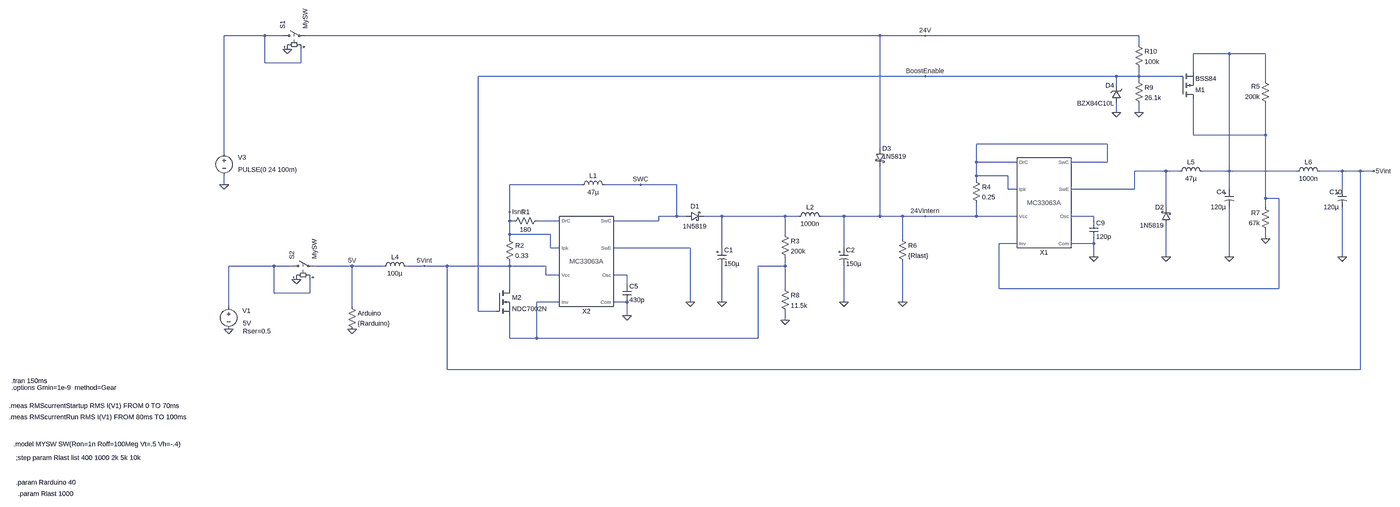
[diagram p0: schematic BuckBoostConverter.asc, whole sheet]
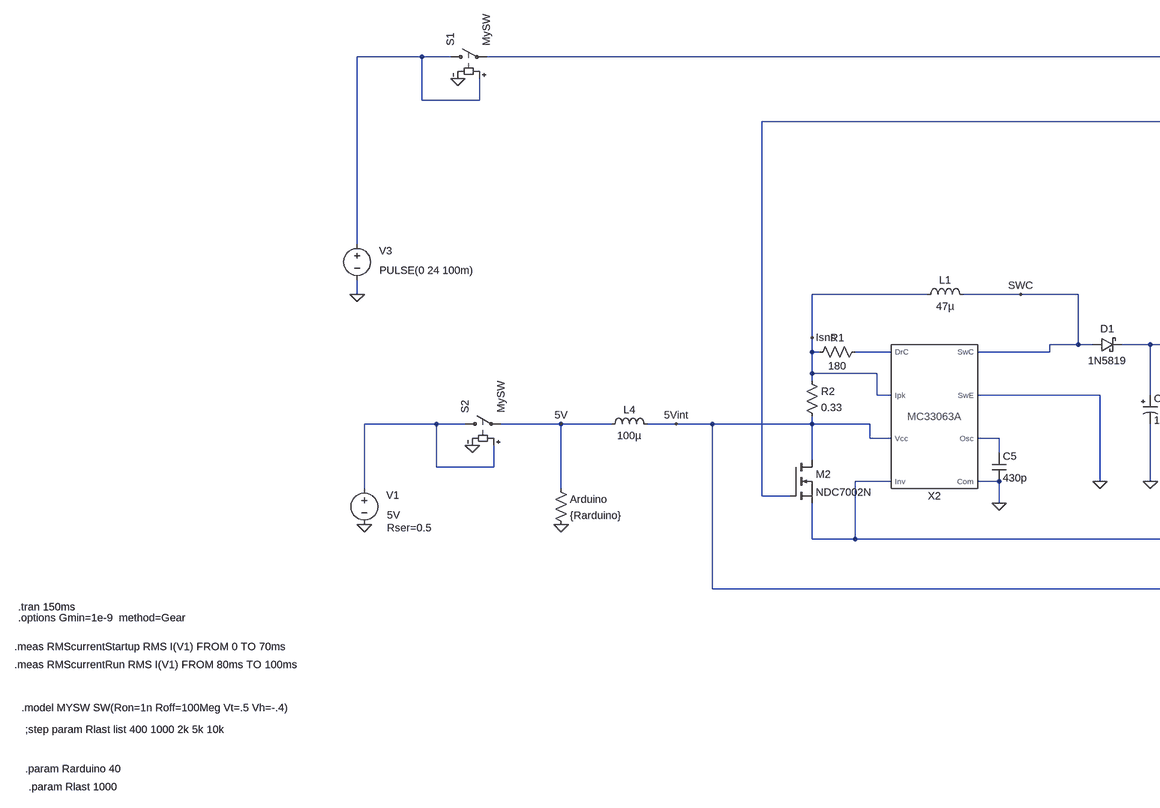
[diagram p1: schematic BuckBoostConverter.asc, part, row 1 of 1, column 1 of 2]
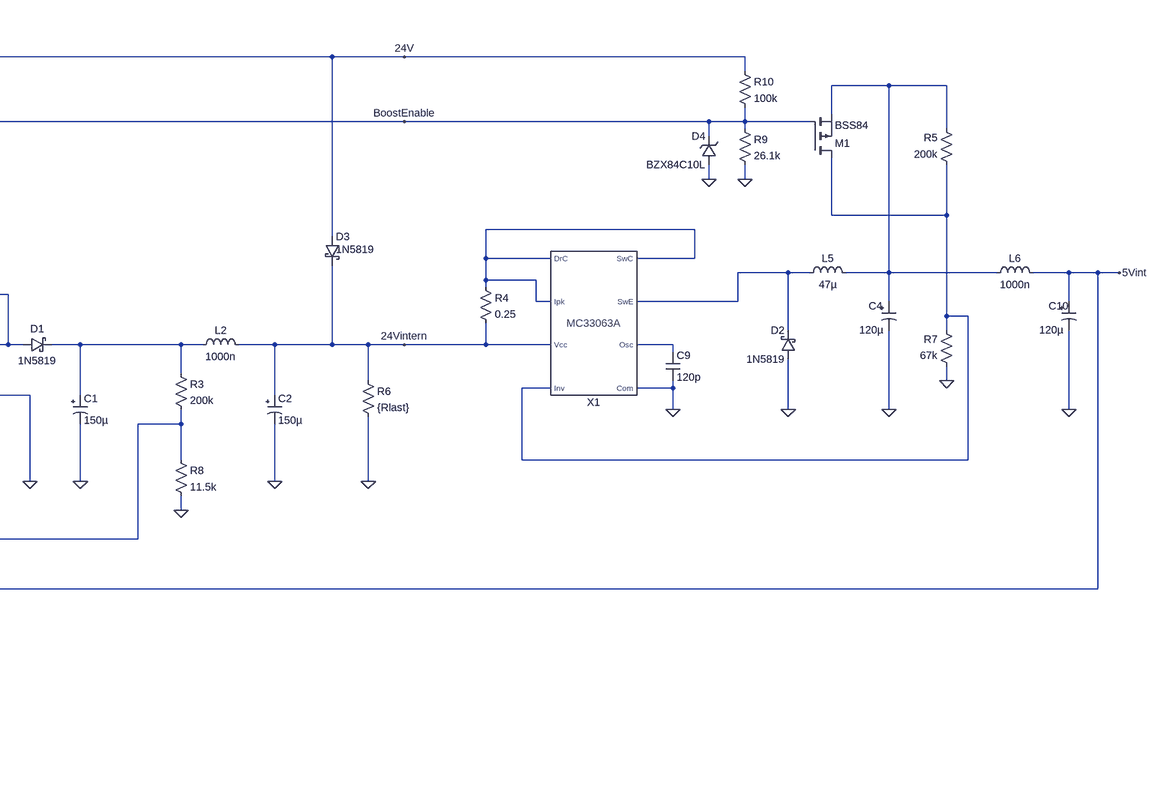
[diagram p2: schematic BuckBoostConverter.asc, part, row 1 of 1, column 2 of 2]
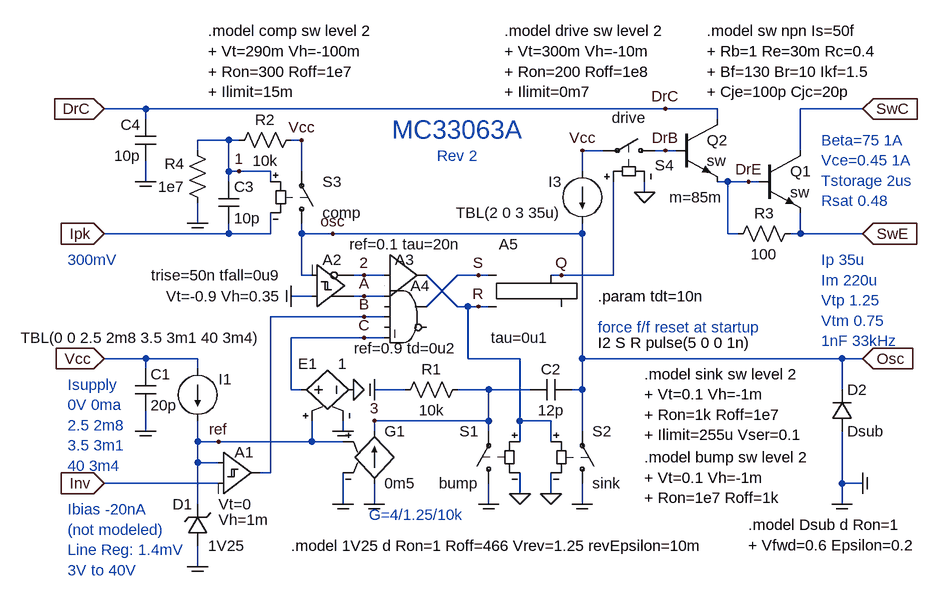
[diagram p3: sub-circuit mc33063a.asc]
BuckBoostConverter.asc, the LTspice schematic file:
Version 4
SHEET 1 3600 1280
WIRE -832 -784 -976 -784
WIRE -768 -784 -832 -784
WIRE 1424 -784 -688 -784
WIRE 1584 -784 1424 -784
WIRE 2688 -784 1584 -784
WIRE 2688 -752 2688 -784
WIRE 3008 -720 2880 -720
WIRE 3136 -720 3008 -720
WIRE -832 -688 -832 -784
WIRE -704 -688 -704 -736
WIRE -704 -688 -832 -688
WIRE 2880 -656 2880 -720
WIRE 1584 -640 0 -640
WIRE 2608 -640 1584 -640
WIRE 2688 -640 2688 -672
WIRE 2688 -640 2608 -640
WIRE 2832 -640 2688 -640
WIRE 2688 -624 2688 -640
WIRE 3136 -624 3136 -720
WIRE 2608 -608 2608 -640
WIRE 2608 -512 2608 -544
WIRE 2688 -512 2688 -544
WIRE 2880 -432 2880 -560
WIRE 3136 -432 3136 -544
WIRE 3136 -432 2880 -432
WIRE 2576 -400 2112 -400
WIRE 1424 -384 1424 -784
WIRE -976 -368 -976 -784
WIRE 2112 -336 2112 -400
WIRE 2256 -336 2112 -336
WIRE 2576 -336 2576 -400
WIRE 2576 -336 2448 -336
WIRE 2784 -304 2672 -304
WIRE 2832 -304 2784 -304
WIRE 3008 -304 3008 -720
WIRE 3008 -304 2912 -304
WIRE 3248 -304 3008 -304
WIRE 3408 -304 3328 -304
WIRE 3472 -304 3408 -304
WIRE 3520 -304 3472 -304
WIRE 2112 -288 2112 -336
WIRE 2224 -288 2112 -288
WIRE 2112 -272 2112 -288
WIRE -976 -256 -976 -288
WIRE 368 -256 112 -256
WIRE 576 -256 448 -256
WIRE 704 -256 576 -256
WIRE 2224 -240 2224 -288
WIRE 2256 -240 2224 -240
WIRE 2672 -240 2672 -304
WIRE 2672 -240 2448 -240
WIRE 3008 -240 3008 -304
WIRE 3408 -240 3408 -304
WIRE 3136 -208 3136 -432
WIRE 3184 -208 3136 -208
WIRE 2784 -176 2784 -304
WIRE 3136 -176 3136 -208
WIRE 112 -160 112 -256
WIRE 704 -144 704 -256
WIRE 704 -144 640 -144
WIRE 736 -144 704 -144
WIRE 864 -144 800 -144
WIRE 1088 -144 864 -144
WIRE 1136 -144 1088 -144
WIRE 1296 -144 1216 -144
WIRE 1424 -144 1424 -320
WIRE 1424 -144 1296 -144
WIRE 1504 -144 1424 -144
WIRE 1584 -144 1504 -144
WIRE 2112 -144 2112 -192
WIRE 2112 -144 1584 -144
WIRE 2256 -144 2112 -144
WIRE 2528 -144 2448 -144
WIRE 112 -128 112 -160
WIRE 128 -128 112 -128
WIRE 288 -128 208 -128
WIRE 640 -128 640 -144
WIRE 640 -128 480 -128
WIRE 2528 -128 2528 -144
WIRE 112 -80 112 -128
WIRE 256 -80 112 -80
WIRE 1088 -80 1088 -144
WIRE 112 -64 112 -80
WIRE 1504 -64 1504 -144
WIRE 3136 -64 3136 -96
WIRE 2256 -48 2192 -48
WIRE 2528 -48 2528 -64
WIRE 2528 -48 2448 -48
WIRE 256 -32 256 -80
WIRE 288 -32 256 -32
WIRE 752 -32 480 -32
WIRE 864 -32 864 -144
WIRE 1296 -32 1296 -144
WIRE 2528 0 2528 -48
WIRE 2784 0 2784 -112
WIRE 3008 0 3008 -176
WIRE 3408 0 3408 -176
WIRE -800 32 -960 32
WIRE -736 32 -800 32
WIRE -496 32 -656 32
WIRE -384 32 -496 32
WIRE -240 32 -304 32
WIRE -160 32 -240 32
WIRE 112 32 112 16
WIRE 112 32 -160 32
WIRE 240 32 112 32
WIRE 1088 32 1088 0
WIRE 1088 32 992 32
WIRE 240 64 240 32
WIRE 288 64 240 64
WIRE 528 64 480 64
WIRE 528 96 528 64
WIRE 112 112 112 32
WIRE 1088 112 1088 32
WIRE 2192 112 2192 -48
WIRE 3184 112 3184 -208
WIRE 3184 112 2192 112
WIRE -800 128 -800 32
WIRE -672 128 -672 80
WIRE -672 128 -800 128
WIRE 288 160 208 160
WIRE 528 160 480 160
WIRE 752 160 752 -32
WIRE 864 160 864 32
WIRE 1296 160 1296 32
WIRE 1504 160 1504 16
WIRE -960 176 -960 32
WIRE -496 176 -496 32
WIRE 0 192 0 -640
WIRE 64 192 0 192
WIRE 528 208 528 160
WIRE 1088 224 1088 192
WIRE 112 288 112 208
WIRE 208 288 208 160
WIRE 208 288 112 288
WIRE 992 288 992 32
WIRE 992 288 208 288
WIRE -160 416 -160 32
WIRE 3472 416 3472 -304
WIRE 3472 416 -160 416
FLAG 864 160 0
FLAG 1504 160 0
FLAG 752 160 0
FLAG 1584 -144 24Vintern
FLAG -496 256 0
FLAG 528 208 0
FLAG 1088 224 0
FLAG -240 32 5Vint
FLAG 112 -160 Isns
FLAG 576 -256 SWC
FLAG -752 -736 0
FLAG 1296 160 0
FLAG -960 256 0
FLAG -496 32 5V
FLAG 2784 0 0
FLAG 2528 0 0
FLAG 3136 -64 0
FLAG 3008 0 0
FLAG 3408 0 0
FLAG 3520 -304 5Vint
FLAG -976 -256 0
FLAG 2688 -512 0
FLAG 2608 -512 0
FLAG -720 80 0
FLAG 1584 -640 BoostEnable
FLAG 1584 -784 24V
SYMBOL voltage -960 160 R0
WINDOW 0 49 31 Left 2
WINDOW 3 50 75 Left 2
WINDOW 123 0 0 Left 2
WINDOW 39 50 103 Left 2
SYMATTR InstName V1
SYMATTR Value 5V
SYMATTR SpiceLine Rser=0.5
SYMBOL res 224 -144 R90
WINDOW 0 0 56 VBottom 2
WINDOW 3 32 56 VTop 2
SYMATTR InstName R1
SYMATTR Value 180
SYMBOL res 96 -80 R0
SYMATTR InstName R2
SYMATTR Value 0.33
SYMBOL schottky 736 -128 R270
WINDOW 0 36 32 VTop 2
WINDOW 3 -4 32 VBottom 2
SYMATTR InstName D1
SYMATTR Value 1N5819
SYMATTR Description Zener Diode
SYMATTR Type zener
SYMBOL polcap 848 -32 R0
WINDOW 3 24 56 Left 2
SYMATTR Value 150µ
SYMATTR InstName C1
SYMATTR SpiceLine V=35 Irms=595m Rser=0.027 Lser=0
SYMATTR Description Capacitor
SYMATTR Type cap
SYMBOL ind 352 -240 R270
WINDOW 0 32 56 VTop 2
WINDOW 3 5 56 VBottom 2
SYMATTR InstName L1
SYMATTR Value 47µ
SYMATTR SpiceLine Ipk=0.85 Rser=0.123 Rpar=32930 Cpar=2.612p mfg="Bourns, Inc." pn="SRR6040A-470M"
SYMBOL res 1488 -80 R0
SYMATTR InstName R6
SYMATTR Value {Rlast}
SYMBOL res -512 160 R0
SYMATTR InstName Arduino
SYMATTR Value {Rarduino}
SYMBOL cap 512 96 R0
SYMATTR InstName C5
SYMATTR Value 430p
SYMBOL res 1072 -96 R0
SYMATTR InstName R3
SYMATTR Value 200k
SYMBOL res 1072 96 R0
SYMATTR InstName R8
SYMATTR Value 11.5k
SYMBOL MC33063A 384 16 M0
WINDOW 0 0 176 Center 2
SYMATTR InstName X2
SYMBOL sw -784 -784 R270
SYMATTR InstName S1
SYMATTR Value MySW
SYMBOL polcap 1280 -32 R0
WINDOW 3 24 56 Left 2
SYMATTR Value 150µ
SYMATTR InstName C2
SYMATTR SpiceLine V=35 Irms=595m Rser=0.027 Lser=0
SYMATTR Description Capacitor
SYMATTR Type cap
SYMBOL ind 1120 -128 R270
WINDOW 0 32 56 VTop 2
WINDOW 3 5 56 VBottom 2
SYMATTR InstName L2
SYMATTR Value 1000n
SYMATTR SpiceLine Ipk=1.2 Rser=0.12 Rpar=0 Cpar=0 mfg="Murata" pn="LQM31PN1R0M00"
SYMBOL ind -400 48 R270
WINDOW 0 32 56 VTop 2
WINDOW 3 5 56 VBottom 2
SYMATTR InstName L4
SYMATTR Value 100µ
SYMATTR SpiceLine Ipk=1.2 Rser=0.12 Rpar=0 Cpar=0
SYMBOL polcap 2992 -240 R0
WINDOW 0 -29 10 Left 2
WINDOW 3 -50 63 Left 2
SYMATTR InstName C4
SYMATTR Value 120µ
SYMATTR Description Capacitor
SYMATTR Type cap
SYMATTR SpiceLine V=10 Irms=3.87298 Rser=0.018 Lser=0
SYMBOL voltage -976 -384 R0
WINDOW 0 49 31 Left 2
WINDOW 3 50 75 Left 2
WINDOW 123 0 0 Left 2
WINDOW 39 0 0 Left 2
SYMATTR InstName V3
SYMATTR Value PULSE(0 24 100m)
SYMBOL res 2096 -288 R0
SYMATTR InstName R4
SYMATTR Value 0.25
SYMBOL schottky 2800 -112 R180
WINDOW 0 24 64 Left 2
WINDOW 3 24 0 Left 2
SYMATTR InstName D2
SYMATTR Value 1N5819
SYMATTR Description Zener Diode
SYMATTR Type zener
SYMBOL ind 2816 -288 R270
WINDOW 0 32 56 VTop 2
WINDOW 3 5 56 VBottom 2
SYMATTR InstName L5
SYMATTR Value 47µ
SYMBOL cap 2512 -128 R0
SYMATTR InstName C9
SYMATTR Value 120p
SYMBOL res 3152 -528 R180
WINDOW 0 36 76 Left 2
WINDOW 3 36 40 Left 2
SYMATTR InstName R5
SYMATTR Value 200k
SYMBOL res 3152 -80 R180
WINDOW 0 36 76 Left 2
WINDOW 3 36 40 Left 2
SYMATTR InstName R7
SYMATTR Value 67k
SYMBOL MC33063A 2352 -192 M0
WINDOW 0 0 176 Center 2
SYMATTR InstName X1
SYMBOL ind 3232 -288 R270
WINDOW 0 32 56 VTop 2
WINDOW 3 5 56 VBottom 2
SYMATTR InstName L6
SYMATTR Value 1000n
SYMATTR SpiceLine Ipk=0.9 Rser=0.2 Rpar=1600 Cpar=1.25p mfg="Würth Elektronik" pn="74479763210A WE-PMI 0603"
SYMBOL polcap 3392 -240 R0
WINDOW 0 -29 10 Left 2
WINDOW 3 -50 63 Left 2
SYMATTR InstName C10
SYMATTR Value 120µ
SYMATTR Description Capacitor
SYMATTR Type cap
SYMATTR SpiceLine V=10 Irms=3.87298 Rser=0.018 Lser=0
SYMBOL pmos 2832 -560 M180
SYMATTR InstName M1
SYMATTR Value BSS84
SYMBOL res 2672 -640 R0
SYMATTR InstName R9
SYMATTR Value 26.1k
SYMBOL schottky 1408 -384 R0
WINDOW 3 24 28 Left 2
SYMATTR Value 1N5819
SYMATTR InstName D3
SYMATTR Description Diode
SYMATTR Type diode
SYMBOL res 2672 -768 R0
SYMATTR InstName R10
SYMATTR Value 100k
SYMBOL zener 2624 -544 R180
WINDOW 0 24 64 Left 2
WINDOW 3 24 0 Left 2
SYMATTR InstName D4
SYMATTR Value BZX84C10L
SYMATTR Description Diode
SYMATTR Type diode
SYMBOL nmos 64 112 R0
SYMATTR InstName M2
SYMATTR Value NDC7002N
SYMBOL sw -752 32 R270
SYMATTR InstName S2
SYMATTR Value MySW
TEXT -2000 456 Left 2 !.tran 150ms
TEXT -2000 480 Left 2 !.options Gmin=1e-9  method=Gear
TEXT -2008 544 Left 2 !.meas RMScurrentStartup RMS I(V1) FROM 0 TO 70ms
TEXT -2008 584 Left 2 !.meas RMScurrentRun RMS I(V1) FROM 80ms TO 100ms
TEXT -1992 680 Left 2 !.model MYSW SW(Ron=1n Roff=100Meg Vt=.5 Vh=-.4)
TEXT -1984 728 Left 2 !;step param Rlast list 400 1000 2k 5k 10k
TEXT -1976 856 Left 2 !.param Rlast 1000
TEXT -1984 816 Left 2 !.param Rarduino 40

mc33063a.asc, the sub-circuit schematic file:
Version 4
SHEET 1 1352 1072
WIRE -608 -64 -672 -64
WIRE 192 -64 -608 -64
WIRE 272 -64 192 -64
WIRE 496 -64 400 -64
WIRE -608 -48 -608 -64
WIRE 272 -48 272 -64
WIRE -480 -16 -528 -16
WIRE -464 -16 -480 -16
WIRE -368 -16 -384 -16
WIRE -528 0 -528 -16
WIRE 96 0 64 0
WIRE 192 0 176 0
WIRE 208 0 192 0
WIRE 400 0 400 -64
WIRE -480 32 -480 -16
WIRE -464 32 -480 32
WIRE -416 32 -464 32
WIRE -368 32 -368 -16
WIRE 64 32 64 0
WIRE -608 48 -608 16
WIRE -480 48 -480 32
WIRE -416 48 -416 32
WIRE 288 48 272 48
WIRE 320 48 288 48
WIRE 336 48 320 48
WIRE 160 64 160 48
WIRE -528 112 -528 80
WIRE -480 128 -480 112
WIRE -480 128 -672 128
WIRE -416 128 -416 96
WIRE -416 128 -480 128
WIRE -368 128 -368 112
WIRE -320 128 -368 128
WIRE 64 128 64 112
WIRE 64 128 -320 128
WIRE 288 128 288 48
WIRE 304 128 288 128
WIRE 400 128 400 96
WIRE 400 128 384 128
WIRE 496 128 400 128
WIRE -368 192 -368 128
WIRE -352 192 -368 192
WIRE -272 192 -288 192
WIRE -240 192 -272 192
WIRE -96 192 -128 192
WIRE -80 192 -96 192
WIRE 32 192 16 192
WIRE 112 192 112 48
WIRE 112 192 32 192
WIRE -352 224 -384 224
WIRE -272 224 -288 224
WIRE -240 224 -272 224
WIRE -176 240 -128 192
WIRE -128 240 -176 192
WIRE -112 240 -128 240
WIRE -96 240 -112 240
WIRE -80 240 -96 240
WIRE -272 256 -416 256
WIRE -240 256 -272 256
WIRE -272 288 -384 288
WIRE -240 288 -272 288
WIRE -608 320 -672 320
WIRE -528 320 -608 320
WIRE -112 320 -112 240
WIRE -32 320 -112 320
WIRE 64 320 64 128
WIRE 464 320 64 320
WIRE 496 320 464 320
WIRE -608 336 -608 320
WIRE -528 336 -528 320
WIRE -384 368 -384 288
WIRE -368 368 -384 368
WIRE -208 368 -256 368
WIRE -80 368 -128 368
WIRE -16 368 -80 368
WIRE 64 368 64 320
WIRE 64 368 48 368
WIRE 464 368 464 320
WIRE -80 416 -80 368
WIRE -80 416 -256 416
WIRE -32 416 -32 320
WIRE 16 416 -32 416
WIRE -608 432 -608 400
WIRE -304 432 -304 416
WIRE -256 432 -256 416
WIRE -80 432 -80 416
WIRE 64 432 64 368
WIRE -528 448 -528 416
WIRE -496 448 -528 448
WIRE -352 448 -352 416
WIRE -352 448 -496 448
WIRE -304 448 -352 448
WIRE -32 448 -32 416
WIRE 16 448 16 416
WIRE -528 480 -528 448
WIRE -496 480 -528 480
WIRE -416 496 -416 256
WIRE -416 496 -432 496
WIRE -496 512 -672 512
WIRE 464 512 464 432
WIRE 496 512 464 512
WIRE -32 528 -32 496
WIRE 16 528 16 496
WIRE -528 544 -528 480
WIRE -304 544 -304 496
WIRE -256 544 -256 512
WIRE -80 544 -80 512
WIRE 64 544 64 512
WIRE 464 544 464 512
WIRE -528 640 -528 608
FLAG -672 -64 DrC
IOPIN -672 -64 In
FLAG -672 128 Ipk
IOPIN -672 128 In
FLAG -672 320 Vcc
IOPIN -672 320 In
FLAG -672 512 Inv
IOPIN -672 512 In
FLAG 496 -64 SwC
IOPIN 496 -64 In
FLAG 496 128 SwE
IOPIN 496 128 In
FLAG 496 320 Osc
IOPIN 496 320 In
FLAG 496 512 Com
IOPIN 496 512 In
FLAG 464 544 COM
FLAG -528 640 COM
FLAG 64 0 Vcc
FLAG 64 544 COM
FLAG -368 -16 Vcc
FLAG 160 64 0
FLAG -464 32 1
FLAG -272 224 A
FLAG -272 256 B
FLAG -96 192 S
FLAG -96 240 R
FLAG 32 192 Q
FLAG 320 48 DrE
FLAG -272 192 2
FLAG -608 48 COM
FLAG -384 224 COM
FLAG -608 432 COM
FLAG 16 528 0
FLAG -32 528 0
FLAG -80 544 COM
FLAG -256 544 COM
FLAG -256 368 COM
FLAG -304 544 COM
FLAG -496 448 ref
FLAG -256 416 3
FLAG -320 128 osc
FLAG -272 288 C
FLAG 192 -64 DrC
FLAG -528 112 COM
FLAG 192 0 DrB
FLAG -288 368 0
FLAG -304 432 COM
SYMBOL cap -624 336 R0
SYMATTR InstName C1
SYMATTR Value 20p
SYMBOL current -528 336 M0
WINDOW 123 0 0 Left 2
WINDOW 39 0 0 Left 2
WINDOW 3 -99 -48 Left 2
WINDOW 0 -32 16 Right 2
SYMATTR Value TBL(0 0 2.5 2m8 3.5 3m1 40 3m4)
SYMATTR InstName I1
SYMBOL zener -512 608 R180
WINDOW 0 24 64 Left 2
WINDOW 3 0 0 Right 2
SYMATTR InstName D1
SYMATTR Value 1V25
SYMBOL Digital\\diffschmtbuf -496 432 R0
WINDOW 3 0 112 Left 2
WINDOW 0 25 32 Left 2
WINDOW 123 0 136 Left 2
SYMATTR Value Vt=0
SYMATTR InstName A1
SYMATTR Value2 Vh=1m
SYMATTR SpiceLine tripdt={tdt}
SYMBOL Digital\\diffschmitt -352 272 M180
WINDOW 3 -48 48 Right 2
WINDOW 0 16 104 Left 2
WINDOW 123 -48 80 Right 2
SYMATTR Value Vt=-0.9 Vh=0.35
SYMATTR InstName A2
SYMATTR Value2 trise=50n tfall=0u9
SYMATTR SpiceLine tripdt={tdt}
SYMBOL Digital\\buf1 -240 128 R0
WINDOW 0 16 40 Left 2
WINDOW 3 32 16 Center 2
SYMATTR InstName A3
SYMATTR Value ref=0.1 tau=20n
SYMATTR Value2 tripdt={tdt}
SYMBOL Digital\\and -208 192 R0
WINDOW 3 0 112 Center 2
SYMATTR Value ref=0.9 td=0u2
SYMATTR InstName A4
SYMATTR Value2 tripdt={tdt}
SYMBOL Digital\\srflop -32 144 R0
WINDOW 3 0 144 Center 2
WINDOW 0 -32 0 Left 2
SYMATTR Value tau=0u1
SYMATTR InstName A5
SYMATTR Value2 tripdt={tdt}
SYMBOL g -256 416 R0
WINDOW 0 16 16 Left 2
WINDOW 3 16 96 Left 2
SYMATTR InstName G1
SYMATTR Value 0m5
SYMBOL res -224 384 R270
WINDOW 0 32 56 VTop 2
WINDOW 3 0 56 VBottom 2
SYMATTR InstName R1
SYMATTR Value 10k
SYMBOL cap 48 352 R90
WINDOW 0 0 32 VBottom 2
WINDOW 3 32 32 VTop 2
SYMATTR InstName C2
SYMATTR Value 12p
SYMBOL sw -80 528 R180
WINDOW 0 16 96 Left 2
WINDOW 3 16 16 Left 2
SYMATTR InstName S1
SYMATTR Value bump
SYMBOL sw 64 528 M180
WINDOW 0 16 96 Left 2
WINDOW 3 16 16 Left 2
SYMATTR InstName S2
SYMATTR Value sink
SYMBOL current 64 32 M0
WINDOW 0 32 16 Left 2
WINDOW 3 32 64 Left 2
SYMATTR InstName I3
SYMATTR Value TBL(2 0 3 35u)
SYMBOL res -480 0 R270
WINDOW 0 32 56 VTop 2
WINDOW 3 0 56 VBottom 2
SYMATTR InstName R2
SYMATTR Value 10k
SYMBOL cap -496 48 R0
SYMATTR InstName C3
SYMATTR Value 10p
SYMBOL sw -368 128 M180
WINDOW 0 32 80 Left 2
WINDOW 3 32 32 Left 2
SYMATTR InstName S3
SYMATTR Value comp
SYMBOL cap -592 -48 M0
SYMATTR InstName C4
SYMATTR Value 10p
SYMBOL sw 192 0 M270
WINDOW 0 -23 16 VLeft 2
WINDOW 3 35 56 VTop 2
SYMATTR InstName S4
SYMATTR Value drive
SYMBOL res 288 144 R270
WINDOW 0 32 56 VTop 2
WINDOW 3 0 56 VBottom 2
SYMATTR InstName R3
SYMATTR Value 100
SYMBOL npn 336 0 R0
WINDOW 0 48 32 Left 2
WINDOW 3 48 64 Left 2
SYMATTR InstName Q1
SYMATTR Value sw
SYMBOL diode 448 432 M180
WINDOW 0 24 64 Left 2
WINDOW 3 24 0 Left 2
SYMATTR InstName D2
SYMATTR Value Dsub
SYMBOL res -512 96 R180
WINDOW 0 36 76 Left 2
WINDOW 3 36 40 Left 2
SYMATTR InstName R4
SYMATTR Value 1e7
SYMBOL npn 208 -48 R0
WINDOW 0 48 32 Left 2
WINDOW 3 48 64 Left 2
WINDOW 123 72 120 Right 2
SYMATTR InstName Q2
SYMATTR Value sw
SYMATTR Value2 m=85m
SYMBOL e -384 368 R270
WINDOW 0 40 40 VLeft 2
WINDOW 3 40 72 VRight 2
SYMATTR InstName E1
SYMATTR Value 1
TEXT -512 -184 Left 2 !.model comp sw level 2\n+ Vt=290m Vh=-100m\n+ Ron=300 Roff=1e7\n+ Ilimit=15m
TEXT 160 344 Left 2 !.model sink sw level 2\n+ Vt=0.1 Vh=-1m\n+ Ron=1k Roff=1e7\n+ Ilimit=255u Vser=0.1
TEXT 160 472 Left 2 !.model bump sw level 2\n+ Vt=0.1 Vh=-1m\n+ Ron=1e7 Roff=1k
TEXT -384 608 Left 2 !.model 1V25 d Ron=1 Roff=466 Vrev=1.25 revEpsilon=10m
TEXT -128 -32 Center 4 ;MC33063A
TEXT -728 168 Left 2 ;300mV
TEXT -728 360 Left 2 ;Isupply\n0V 0ma\n2.5 2m8\n3.5 3m1\n40 3m4
TEXT -728 552 Left 2 ;Ibias -20nA\n(not modeled)\nLine Reg: 1.4mV\n3V to 40V
TEXT 432 -16 Left 2 ;Beta=75 1A\nVce=0.45 1A\nTstorage 2us\nRsat 0.48
TEXT 432 168 Left 2 ;Ip 35u\nIm 220u\nVtp 1.25\nVtm 0.75\n1nF 33kHz
TEXT 88 224 Left 2 !.param tdt=10n
TEXT 88 296 Left 2 !I2 S R pulse(5 0 0 1n)
TEXT -264 560 Left 2 ;G=4/1.25/10k
TEXT 88 272 Left 2 ;force f/f reset at startup
TEXT 320 576 Left 2 !.model Dsub d Ron=1\n+ Vfwd=0.6 Epsilon=0.2
TEXT 256 -184 Left 2 !.model sw npn Is=50f\n+ Rb=1 Re=30m Rc=0.4\n+ Bf=130 Br=10 Ikf=1.5\n+ Cje=100p Cjc=20p
TEXT -56 -184 Left 2 !.model drive sw level 2\n+ Vt=300m Vh=-10m\n+ Ron=200 Roff=1e8\n+ Ilimit=0m7
TEXT -128 8 Center 2 ;Rev 2

The netlist it stands for:
* BuckBoostConverter.asc
V1 N009 0 5V Rser=0.5
R1 N008 Isns 180
R2 Isns 5Vint 0.33
D1 SWC N006 1N5819
C1 N006 0 150µ V=35 Irms=595m Rser=0.027 Lser=0
L1 Isns SWC 47µ Ipk=0.85 Rser=0.123 Rpar=32930 Cpar=2.612p mfg="Bourns, Inc." pn="SRR6040A-470M"
R6 24Vintern 0 {Rlast}
R§Arduino 5V 0 {Rarduino}
C5 N011 0 430p
R3 N006 N010 200k
R8 N010 0 11.5k
XX2 SWC 0 N011 0 N010 5Vint Isns N008 mc33063a
S1 N001 24V N001 0 MySW
C2 24Vintern 0 150µ V=35 Irms=595m Rser=0.027 Lser=0
L2 N006 24Vintern 1000n Ipk=1.2 Rser=0.12 Rpar=0 Cpar=0 mfg="Murata" pn="LQM31PN1R0M00"
L4 5V 5Vint 100µ Ipk=1.2 Rser=0.12 Rpar=0 Cpar=0
C4 N002 0 120µ V=10 Irms=3.87298 Rser=0.018 Lser=0
V3 N001 0 PULSE(0 24 100m)
R4 N004 24Vintern 0.25
D2 0 N005 1N5819
L5 N005 N002 47µ
C9 N007 0 120p
R5 N003 N002 200k
R7 0 N003 67k
XX1 N004 N005 N007 0 N003 24Vintern N004 N004 mc33063a
L6 N002 5Vint 1000n Ipk=0.9 Rser=0.2 Rpar=1600 Cpar=1.25p mfg="Würth Elektronik" pn="74479763210A WE-PMI 0603"
C10 5Vint 0 120µ V=10 Irms=3.87298 Rser=0.018 Lser=0
M1 N003 BoostEnable N002 N002 BSS84
R9 BoostEnable 0 26.1k
D3 24V 24Vintern 1N5819
R10 24V BoostEnable 100k
D4 0 BoostEnable BZX84C10L
M2 5Vint BoostEnable N010 N010 NDC7002N
S2 N009 5V N009 0 MySW

* block symbol definitions
.subckt mc33063a SwC SwE Osc Com Inv Vcc Ipk DrC
C1 Vcc Com 20p
I1 Vcc ref TBL(0 0 2.5 2m8 3.5 3m1 40 3m4)
D1 Com ref 1V25
A1 ref Inv 0 0 0 0 B 0 SCHMITT Vt=0 Vh=1m tripdt={tdt}
A2 Com Osc 0 0 0 2 A 0 SCHMITT Vt=-0.9 Vh=0.35 trise=50n tfall=0u9 tripdt={tdt}
A3 2 0 0 0 0 0 R 0 BUF ref=0.1 tau=20n tripdt={tdt}
A4 A 0 B 0 C 0 S 0 AND ref=0.9 td=0u2 tripdt={tdt}
A5 S R 0 0 0 0 Q 0 SRFLOP tau=0u1 tripdt={tdt}
G1 Com 3 ref Com 0m5
R1 Com 3 10k
C2 Osc 3 12p
S1 Com 3 R 0 bump
S2 Com Osc R 0 sink
I3 Vcc Osc TBL(2 0 3 35u)
R2 1 Vcc 10k
C3 1 Ipk 10p
S3 Osc Vcc 1 Ipk comp
C4 DrC Com 10p
S4 DrB Vcc Q 0 drive
R3 DrE SwE 100
Q1 SwC DrE SwE 0 sw
D2 Com Osc Dsub
R4 Com 1 1e7
Q2 DrC DrB DrE 0 sw m=85m
E1 C 0 ref Com 1
.model comp sw level 2
+ Vt=290m Vh=-100m
+ Ron=300 Roff=1e7
+ Ilimit=15m
.model sink sw level 2
+ Vt=0.1 Vh=-1m
+ Ron=1k Roff=1e7
+ Ilimit=255u Vser=0.1
.model bump sw level 2
+ Vt=0.1 Vh=-1m
+ Ron=1e7 Roff=1k
.model 1V25 d Ron=1 Roff=466 Vrev=1.25 revEpsilon=10m
* MC33063A
* 300mV
* Isupply
* 0V 0ma
* 2.5 2m8
* 3.5 3m1
* 40 3m4
* Ibias -20nA
* (not modeled)
* Line Reg: 1.4mV
* 3V to 40V
* Beta=75 1A
* Vce=0.45 1A
* Tstorage 2us
* Rsat 0.48
* Ip 35u
* Im 220u
* Vtp 1.25
* Vtm 0.75
* 1nF 33kHz
.param tdt=10n
I2 S R pulse(5 0 0 1n)
* G=4/1.25/10k
* force f/f reset at startup
.model Dsub d Ron=1
+ Vfwd=0.6 Epsilon=0.2
.model sw npn Is=50f
+ Rb=1 Re=30m Rc=0.4
+ Bf=130 Br=10 Ikf=1.5
+ Cje=100p Cjc=20p
.model drive sw level 2
+ Vt=300m Vh=-10m
+ Ron=200 Roff=1e8
+ Ilimit=0m7
* Rev 2
.ends mc33063a

.model D D
.lib standard.dio
.model NPN NPN
.model PNP PNP
.lib standard.bjt
.model NMOS NMOS
.model PMOS PMOS
.lib standard.mos
.tran 150ms
.options Gmin=1e-9  method=Gear
.meas RMScurrentStartup RMS I(V1) FROM 0 TO 70ms
.meas RMScurrentRun RMS I(V1) FROM 80ms TO 100ms
.model MYSW SW(Ron=1n Roff=100Meg Vt=.5 Vh=-.4)
;step param Rlast list 400 1000 2k 5k 10k
.param Rlast 1000
.param Rarduino 40
.backanno
.end